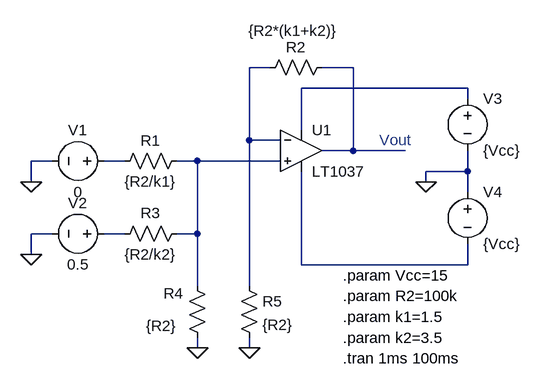
[diagram p0: schematic scheme5.asc]
scheme5.asc, the LTspice schematic file:
Version 4.1
SHEET 1 880 680
WIRE 160 32 128 32
WIRE 288 32 240 32
WIRE 464 64 208 64
WIRE 464 80 464 64
WIRE 208 128 208 64
WIRE 128 144 128 32
WIRE 176 144 128 144
WIRE 288 160 288 32
WIRE 288 160 240 160
WIRE 368 160 288 160
WIRE -176 176 -208 176
WIRE -64 176 -96 176
WIRE 48 176 16 176
WIRE 176 176 48 176
WIRE 464 192 464 160
WIRE 464 192 400 192
WIRE -208 208 -208 176
WIRE 400 208 400 192
WIRE 464 224 464 192
WIRE -176 288 -208 288
WIRE -64 288 -96 288
WIRE 48 288 48 176
WIRE 48 288 16 288
WIRE -208 320 -208 288
WIRE 208 336 208 192
WIRE 464 336 464 304
WIRE 464 336 208 336
WIRE 48 368 48 288
WIRE 128 368 128 144
WIRE 48 464 48 448
WIRE 128 464 128 448
FLAG -208 320 0
FLAG -208 208 0
FLAG 400 208 0
FLAG 48 464 0
FLAG 128 464 0
SYMBOL OpAmps\\LT1037 208 96 R0
SYMATTR InstName U1
SYMBOL res 32 160 R90
WINDOW 0 0 56 VBottom 2
WINDOW 3 32 56 VTop 2
SYMATTR InstName R1
SYMATTR Value {R2/k1}
SYMBOL res 256 16 R90
WINDOW 0 0 56 VBottom 2
WINDOW 3 -56 60 VTop 2
SYMATTR InstName R2
SYMATTR Value {R2*(k1+k2)}
SYMBOL res 32 272 R90
WINDOW 0 0 56 VBottom 2
WINDOW 3 32 56 VTop 2
SYMATTR InstName R3
SYMATTR Value {R2/k2}
SYMBOL res 32 352 R0
WINDOW 0 -36 28 Left 2
WINDOW 3 -63 78 Left 2
SYMATTR InstName R4
SYMATTR Value {R2}
SYMBOL res 112 352 R0
SYMATTR InstName R5
SYMATTR Value {R2}
SYMBOL voltage -80 176 R90
WINDOW 0 -32 56 VBottom 2
WINDOW 3 32 56 VTop 2
SYMATTR InstName V1
SYMATTR Value 0
SYMBOL voltage -80 288 R90
WINDOW 0 -32 56 VBottom 2
WINDOW 3 32 56 VTop 2
SYMATTR InstName V2
SYMATTR Value 0.5
SYMBOL voltage 464 64 R0
SYMATTR InstName V3
SYMATTR Value {Vcc}
SYMBOL voltage 464 208 R0
SYMATTR InstName V4
SYMATTR Value {Vcc}
TEXT 328 144 Left 2 ;Vout
TEXT 272 416 Left 2 !.param k1=1.5
TEXT 272 448 Left 2 !.param k2=3.5
TEXT 272 384 Left 2 !.param R2=100k
TEXT 272 352 Left 2 !.param Vcc=15
TEXT 272 480 Left 2 !.tran 1ms 100ms

The netlist it stands for:
* scheme5.asc
X§U1 N005 N001 N003 N007 N002 LT1037  ; pins In+ In- V+ V- OUT
R1 N005 N004 {R2/k1}
R2 N002 N001 {R2*(k1+k2)}
R3 N005 N006 {R2/k2}
R4 N005 0 {R2}
R5 N001 0 {R2}
V1 N004 0 0
V2 N006 0 0.5
V3 N003 0 {Vcc}
V4 0 N007 {Vcc}
* Vout
.param k1=1.5
.param k2=3.5
.param R2=100k
.param Vcc=15
.tran 1ms 100ms
.backanno
.end